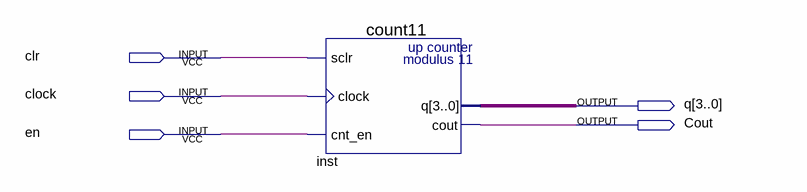
[diagram p0: schematic sheet]
// Quartus schematic count11.bdf as structural Verilog: 1 symbols, 5 pins
module count11 (
  input  clr,
  input  clock,
  input  en,
  output [3:0] q,
  output Cout
);

  count11 inst (.sclr(clr), .clock(clock), .cnt_en(en), .q(q), .cout(Cout));
endmodule
